# Altium project Sayma_AMC.PrjPcb (part 11 of 18)

## Sheet CPU_LPC1776.SchDoc: Sayma AMC
size 420 x 297 mm; $$Internal___BlkDate: 17:09:51_11-23-16; $$Internal_Resolution: 00001mm; $$NotCommonProperty_@NAME: CPU_LPC1776; $$NotCommonProperty_@PRINTORDER: 14; $$NotCommonProperty_@SHEET: 1; $$NotCommonProperty_@SHEETTOTAL: 30; $$NotCommonProperty_FORWARD_PCB: 0; CmpIndex: 51; Drawing Author: G.Kasprowicz; Drawing Number: Sayma AMC; Drawing Project: AMC FMC Carrier Board; Drawing Revision: 2.0; SymIndex: 1557; CheckedBy: P.Kulik,T.Przywozki,W.Ruclo; Author: G.Kasprowicz; CompanyName: WUT ISE; DrawnBy: G.Kasprowicz; Organization: WUT ISE; Address1: PW ISE; Address2: Nowowiejska 15/19 00-665 Warsaw; Address3: gkasprow@gmail.com; DocumentNumber: 5; Revision: 2; SheetNumber: 5; SheetTotal: 32; ModifiedBy: -; CheckedDate: -; Title2: MMC; DivGrp: WUT ISE; Designer: G.Kasprowicz; ModifiedDate: -; ProjectName: Sensor Box
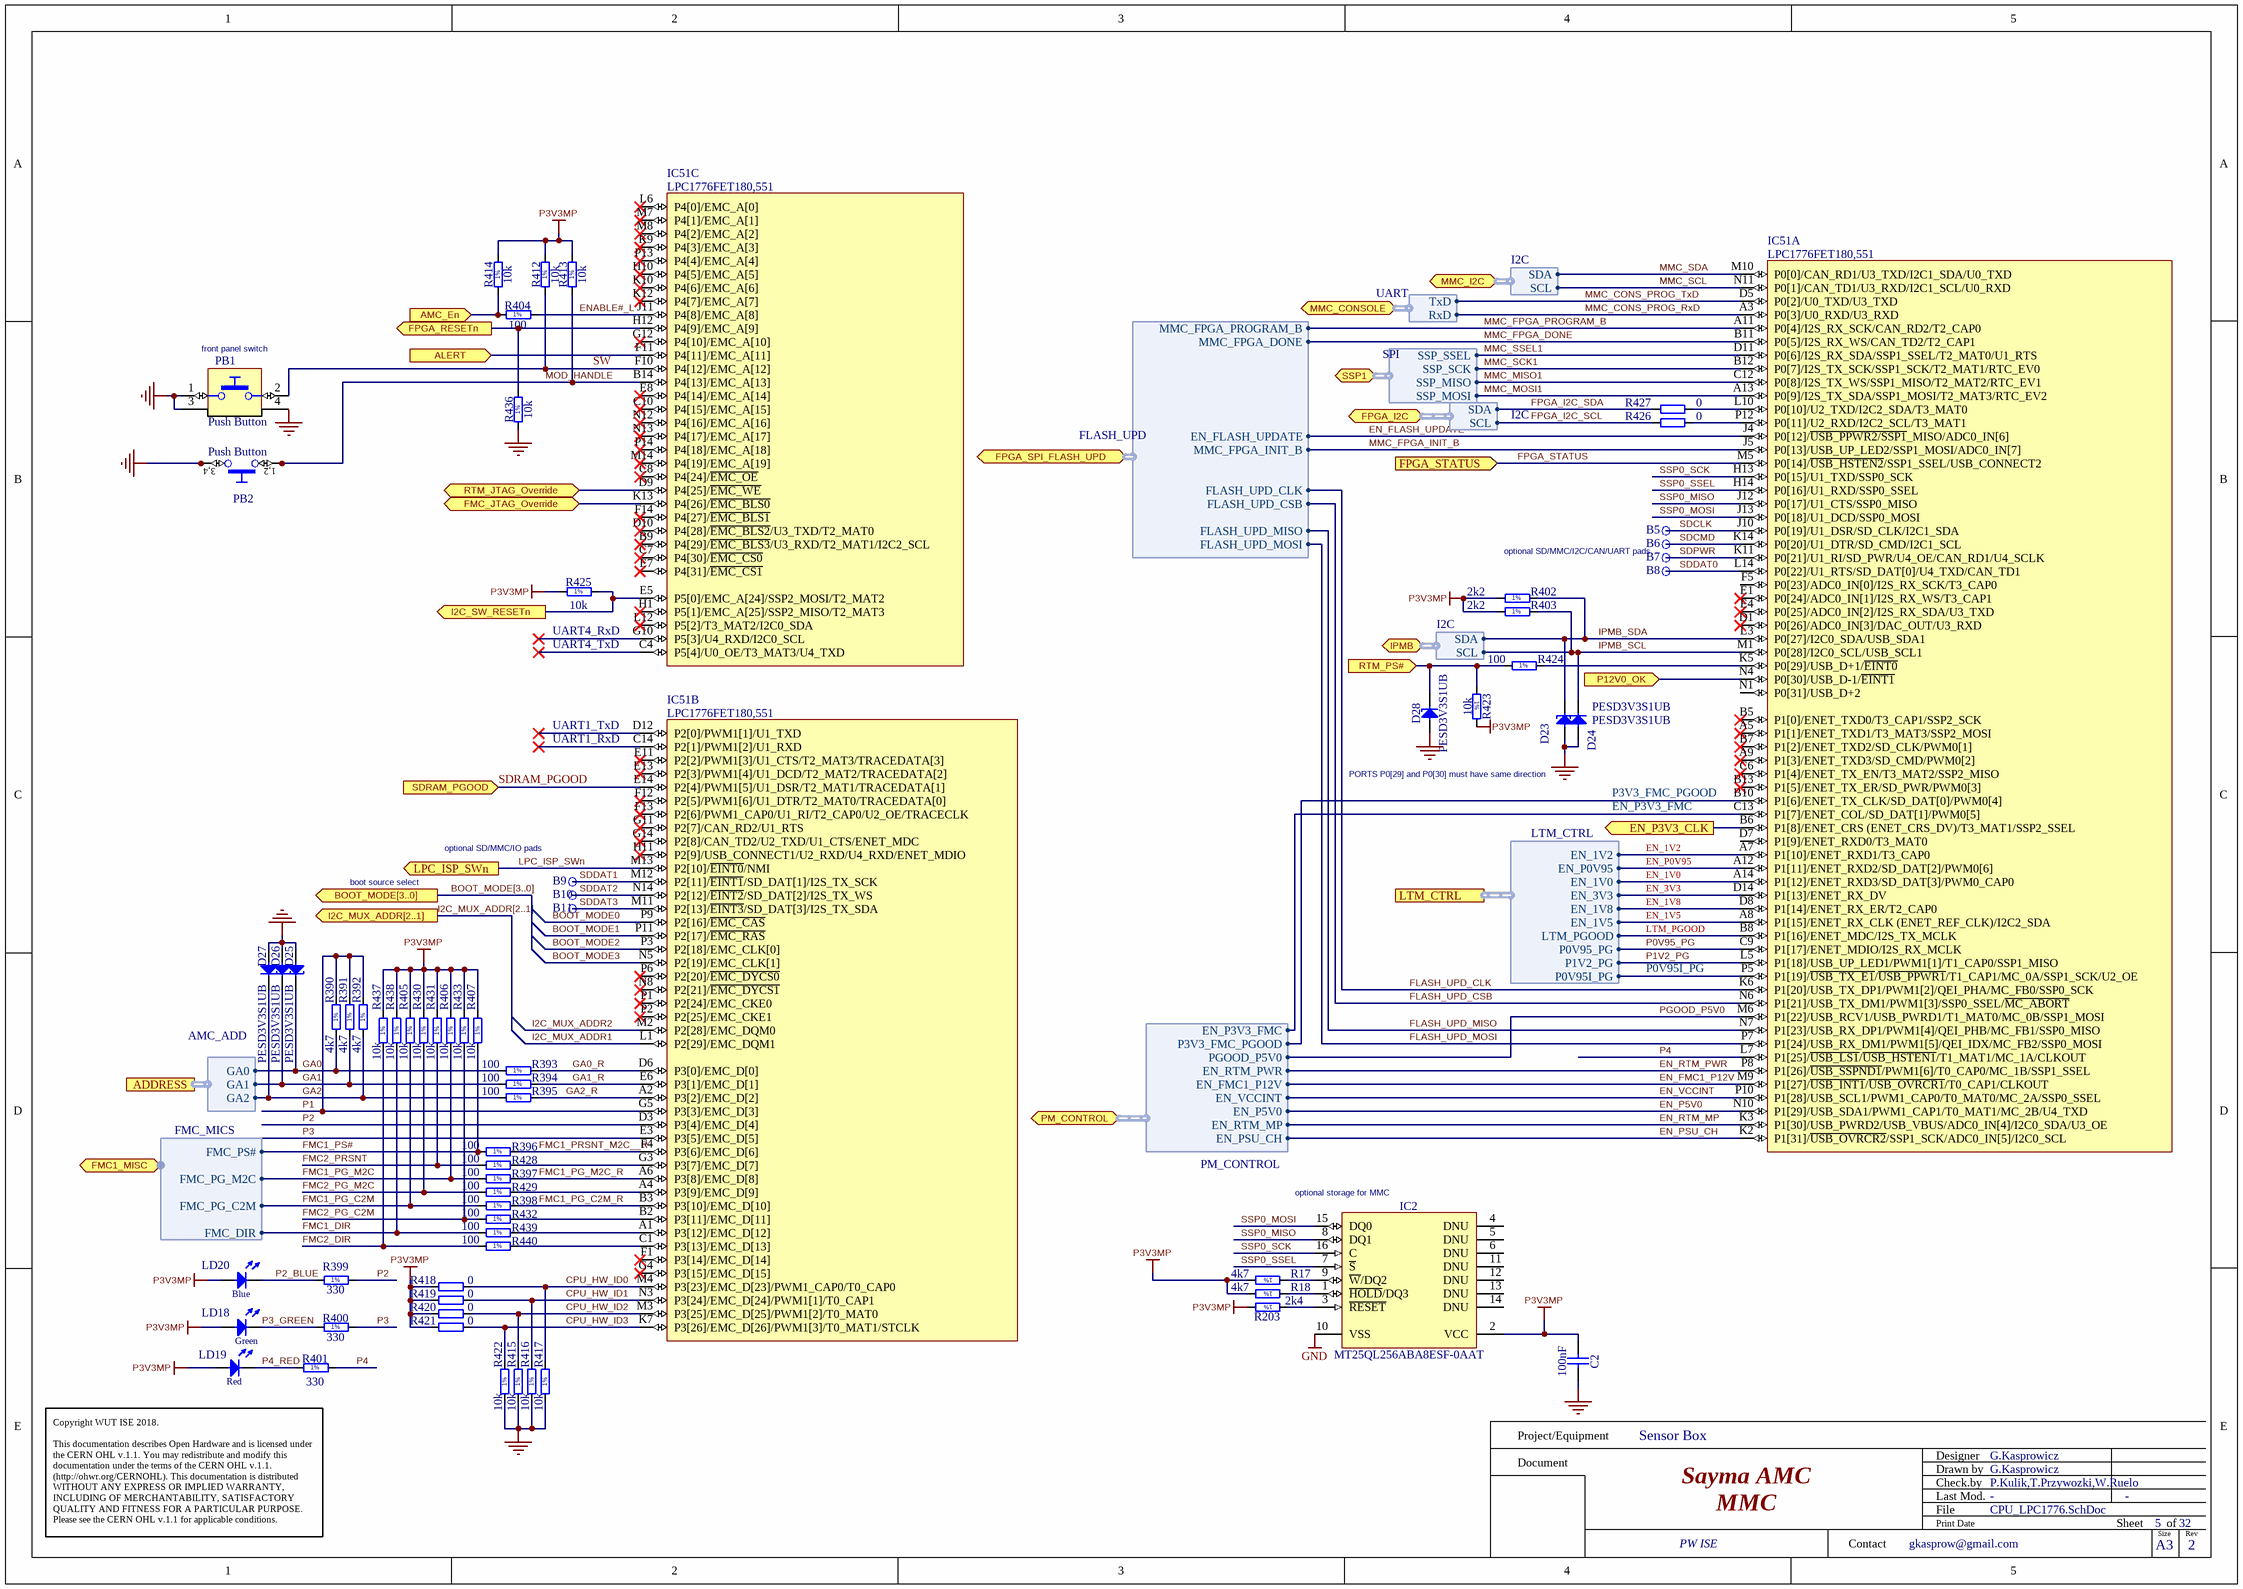
[diagram p18: CPU_LPC1776.SchDoc]

### Parts
B5  SMD_PAD_D1MM  [C100]  (value not drawn)
B6  SMD_PAD_D1MM  [C100]  (value not drawn)
B7  SMD_PAD_D1MM  [C100]  (value not drawn)
B8  SMD_PAD_D1MM  [C100]  (value not drawn)
B9  SMD_PAD_D1MM  [C100]  (value not drawn)
B10  SMD_PAD_D1MM  [C100]  (value not drawn)
B11  SMD_PAD_D1MM  [C100]  (value not drawn)
C2  100nF  [CAPC0603X33N]
D23  PESD3V3S1UB  [SODFL1608X65N]
D24  PESD3V3S1UB  [SODFL1608X65N]
D25  PESD3V3S1UB  [SODFL1608X65N]
D26  PESD3V3S1UB  [SODFL1608X65N]
D27  PESD3V3S1UB  [SODFL1608X65N]
D28  PESD3V3S1UB  [SODFL1608X65N]
IC2  MT25QL256ABA8ESF-0AAT  [SOIC127P1030X265-16N]
IC51  LPC1776FET180,551  [BGA180C80P14X14_1200X1200X120]  (parts A,B,C of 5)
LD18  Green  [LED_AVAGO_HSME-C120]
LD19  Red  [LED_KINGBRIGHT_KPH-1608SURCK]
LD20  Blue  [LED_AVAGO_HSMR-C120]  (value not drawn)
PB1  Push Button  [PB_ALPS_SKHHLQA010]
PB2  Push Button  [SW_C&K_HDT0001]
R17  4k7  [RESC1005X40N]
R18  4k7  [RESC1005X40N]
R203  2k4  [RESC1005X40N]
R390  4k7  [RESC1005X40N]
R391  4k7  [RESC1005X40N]
R392  4k7  [RESC1005X40N]
R393  100  [RESC1005X40N]
R394  100  [RESC1005X40N]
R395  100  [RESC1005X40N]
R396  100  [RESC1005X40N]
R397  100  [RESC1005X40N]
R398  100  [RESC1005X40N]
R399  330  [RESC1005X40N]
R400  330  [RESC1005X40N]
R401  330  [RESC1005X40N]
R402  2k2  [RESC1005X40N]
R403  2k2  [RESC1005X40N]
R404  100  [RESC1005X40N]
R405  10k  [RESC1005X40N]
R406  10k  [RESC1005X40N]
R407  10k  [RESC1005X40N]
R412  10k  [RESC1005X40N]
R413  10k  [RESC1005X40N]
R414  10k  [RESC1005X40N]
R415  10k  [RESC1005X40N]
R416  10k  [RESC1005X40N]
R417  10k  [RESC1005X40N]
R418  0  [RESC1005X40N]
R419  0  [RESC1005X40N]
R420  0  [RESC1005X40N]
R421  0  [RESC1005X40N]
R422  10k  [RESC1005X40N]
R423  10k  [RESC1005X40N]
R424  100  [RESC1005X40N]
R425  10k  [RESC1005X40N]
R426  0  [RESC1005X40N]
R427  0  [RESC1005X40N]
R428  100  [RESC1005X40N]
R429  100  [RESC1005X40N]
R430  10k  [RESC1005X40N]
R431  10k  [RESC1005X40N]
R432  100  [RESC1005X40N]
R433  10k  [RESC1005X40N]
R436  10k  [RESC1005X40N]
R437  10k  [RESC1005X40N]
R438  10k  [RESC1005X40N]
R439  100  [RESC1005X40N]
R440  100  [RESC1005X40N]

### Ports
ADDRESS (harness AMC_ADD), ALERT (in), AMC_En (in), BOOT_MODE[3..0] (out), EN_P3V3_CLK (out), FMC1_MISC (bidir, harness FMC_MICS), FMC_JTAG_Override (bidir), FPGA_I2C (bidir, harness I2C), FPGA_RESETn (out), FPGA_SPI_FLASH_UPD (bidir, harness FLASH_UPD), FPGA_STATUS (in), I2C_MUX_ADDR[2..1] (out), I2C_SW_RESETn (out), IPMB (bidir, harness I2C), LPC_ISP_SWn (out), LTM_CTRL (harness LTM_CTRL), MMC_CONSOLE (bidir, harness UART), MMC_I2C (bidir, harness I2C), P12V0_OK (in), PM_CONTROL (bidir, harness PM_CONTROL), RTM_JTAG_Override (bidir), RTM_PS# (in), SDRAM_PGOOD (in), SSP1 (bidir, harness SPI)

### Harnesses
AMC_ADD: GA0, GA1, GA2
FMC_MICS: FMC_PS#, FMC_PG_M2C, FMC_PG_C2M, FMC_DIR
I2C: SCL, SDA
FLASH_UPD: MMC_FPGA_PROGRAM_B, MMC_FPGA_DONE, EN_FLASH_UPDATE, MMC_FPGA_INIT_B, FLASH_UPD_CLK, FLASH_UPD_CSB, FLASH_UPD_MISO, FLASH_UPD_MOSI
PM_CONTROL: PGOOD_P5V0, EN_RTM_PWR, EN_FMC1_P12V, EN_VCCINT, EN_P5V0, EN_RTM_MP, EN_PSU_CH, EN_P3V3_FMC, P3V3_FMC_PGOOD
UART: RxD, TxD
SPI: SSP_SCK, SSP_SSEL, SSP_MISO, SSP_MOSI
LTM_CTRL: EN_1V0, EN_3V3, EN_1V8, EN_1V5, LTM_PGOOD, EN_1V2, EN_P0V95, P1V2_PG, P0V95I_PG, P0V95_PG

### Nets
GND: C2.1 D23.2(A) D24.2(A) D25.2(A) D26.2(A) D27.2(A) D28.2(A) IC2.10(VSS) PB1.1 PB1.3 PB1.4 PB2.3 PB2.4 R415.1 R416.1 R417.1 R422.1 R436.1
P3V3MP: C2.2 IC2.2(VCC) LD18.2(A) LD19.2(A) LD20.2(A) R17.2 R18.2 R203.2 R402.1 R403.1 R405.2 R406.2 R407.2 R412.2 R413.2 R414.2 R418.1 R419.1 R420.1 R421.1 R423.2 R425.1 R430.2 R431.2 R433.2 R437.2 R438.2
AMC_En: R404.1 R414.1 ; port AMC_En
BOOT_MODE0: IC51.P9(P2[16]/~{EMC_CAS})
BOOT_MODE1: IC51.P11(P2[17]/~{EMC_RAS})
BOOT_MODE2: IC51.P3(P2[18]/EMC_CLK[0])
BOOT_MODE3: IC51.N5(P2[19]/EMC_CLK[1])
CPU_HW_ID0: IC51.M4(P3[23]/EMC_D[23]/PWM1_CAP0/T0_CAP0) R417.2 R418.2
CPU_HW_ID1: IC51.N3(P3[24]/EMC_D[24]/PWM1[1]/T0_CAP1) R416.2 R419.2
CPU_HW_ID2: IC51.M3(P3[25]/EMC_D[25]/PWM1[2]/T0_MAT0) R415.2 R420.2
CPU_HW_ID3: IC51.K7(P3[26]/EMC_D[26]/PWM1[3]/T0_MAT1/STCLK) R421.2 R422.2
EN_1V0: IC51.A14(P1[12]/ENET_RXD3/SD_DAT[3]/PWM0_CAP0) ; port LTM_CTRL.EN_1V0
EN_1V2: IC51.A7(P1[10]/ENET_RXD1/T3_CAP0) ; port LTM_CTRL.EN_1V2
EN_1V5: IC51.A8(P1[15]/ENET_RX_CLK_(ENET_REF_CLK)/I2C2_SDA) ; port LTM_CTRL.EN_1V5
EN_1V8: IC51.D8(P1[14]/ENET_RX_ER/T2_CAP0) ; port LTM_CTRL.EN_1V8
EN_3V3: IC51.D14(P1[13]/ENET_RX_DV) ; port LTM_CTRL.EN_3V3
EN_FLASH_UPDATE: IC51.J4(P0[12]/~{USB_PPWR2/SSP1}_MISO/ADC0_IN[6]) ; port FPGA_SPI_FLASH_UPD.EN_FLASH_UPDATE
EN_FMC1_P12V: IC51.M9(P1[27]/~{USB_INT1}/~{USB_OVRCR1}/T0_CAP1/CLKOUT) ; port PM_CONTROL.EN_FMC1_P12V
EN_P0V95: IC51.A12(P1[11]/ENET_RXD2/SD_DAT[2]/PWM0[6]) ; port LTM_CTRL.EN_P0V95
EN_P3V3_FMC: IC51.C13(P1[7]/ENET_COL/SD_DAT[1]/PWM0[5]) ; port PM_CONTROL.EN_P3V3_FMC
EN_P5V0: IC51.N10(P1[29]/USB_SDA1/PWM1_CAP1/T0_MAT1/MC_2B/U4_TXD) ; port PM_CONTROL.EN_P5V0
EN_PSU_CH: IC51.K2(P1[31]/~{USB_OVRCR2}/SSP1_SCK/ADC0_IN[5]/I2C0_SCL) ; port PM_CONTROL.EN_PSU_CH
EN_RTM_MP: IC51.K3(P1[30]/USB_PWRD2/USB_VBUS/ADC0_IN[4]/I2C0_SDA/U3_OE) ; port PM_CONTROL.EN_RTM_MP
EN_RTM_PWR: IC51.P8(P1[26]/~{USB_SSPND1}/PWM1[6]/T0_CAP0/MC_1B/SSP1_SSEL) ; port PM_CONTROL.EN_RTM_PWR
EN_VCCINT: IC51.P10(P1[28]/USB_SCL1/PWM1_CAP0/T0_MAT0/MC_2A/SSP0_SSEL) ; port PM_CONTROL.EN_VCCINT
ENABLE#_L: IC51.J11(P4[8]/EMC_A[8]) R404.2
FLASH_UPD_CLK: IC51.K6(P1[20]/USB_TX_DP1/PWM1[2]/QEI_PHA/MC_FB0/SSP0_SCK) ; port FPGA_SPI_FLASH_UPD.FLASH_UPD_CLK
FLASH_UPD_CSB: IC51.N6(P1[21]/USB_TX_DM1/PWM1[3]/SSP0_SSEL/~{MC_ABORT}) ; port FPGA_SPI_FLASH_UPD.FLASH_UPD_CSB
FLASH_UPD_MISO: IC51.N7(P1[23]/USB_RX_DP1/PWM1[4]/QEI_PHB/MC_FB1/SSP0_MISO) ; port FPGA_SPI_FLASH_UPD.FLASH_UPD_MISO
FLASH_UPD_MOSI: IC51.P7(P1[24]/USB_RX_DM1/PWM1[5]/QEI_IDX/MC_FB2/SSP0_MOSI) ; port FPGA_SPI_FLASH_UPD.FLASH_UPD_MOSI
FMC1_DIR: R438.1 R439.1 ; port FMC1_MISC.FMC_DIR  [project net CLK_DIR]
FMC1_PG_C2M: R398.1 R405.1 ; port FMC1_MISC.FMC_PG_C2M
FMC1_PG_C2M_R: IC51.B3(P3[10]/EMC_D[10]) R398.2
FMC1_PG_M2C: R397.1 R406.1 ; port FMC1_MISC.FMC_PG_M2C
FMC1_PG_M2C_R: IC51.A6(P3[8]/EMC_D[8]) R397.2
FMC1_PRSNT_M2C__R: IC51.F4(P3[6]/EMC_D[6]) R396.2
FMC1_PS#: R396.1 R407.1 ; port FMC1_MISC.FMC_PS#
FMC2_DIR: R437.1 R440.1
FMC2_PG_C2M: R432.1 R433.1
FMC2_PG_M2C: R429.1 R430.1
FMC2_PRSNT: R428.1 R431.1
FPGA_I2C_SCL: R426.1 ; port FPGA_I2C.SCL
FPGA_I2C_SDA: R427.1 ; port FPGA_I2C.SDA
FPGA_RESETn: IC51.H12(P4[9]/EMC_A[9]) R436.2 ; port FPGA_RESETn
FPGA_STATUS: IC51.M5(P0[14]/~{USB_HSTEN2}/SSP1_SSEL/USB_CONNECT2) ; port FPGA_STATUS
GA0: D25.1(C) R390.1 R393.1 ; port ADDRESS.GA0
GA0_R: IC51.D6(P3[0]/EMC_D[0]) R393.2
GA1: D26.1(C) R391.1 R394.1 ; port ADDRESS.GA1
GA1_R: IC51.E6(P3[1]/EMC_D[1]) R394.2
GA2: D27.1(C) R392.1 R395.1 ; port ADDRESS.GA2
GA2_R: IC51.A2(P3[2]/EMC_D[2]) R395.2
I2C_MUX_ADDR1: IC51.L1(P2[29]/EMC_DQM1)
I2C_MUX_ADDR2: IC51.M2(P2[28]/EMC_DQM0)
IPMB_SCL: D24.1(C) IC51.M1(P0[28]/I2C0_SCL/USB_SCL1) R403.2 ; port IPMB.SCL
IPMB_SDA: D23.1(C) IC51.L3(P0[27]/I2C0_SDA/USB_SDA1) R402.2 ; port IPMB.SDA
LPC_ISP_SWn: IC51.M13(P2[10]/~{EINT0}/NMI) ; port LPC_ISP_SWn
LTM_PGOOD: IC51.B8(P1[16]/ENET_MDC/I2S_TX_MCLK) ; port LTM_CTRL.LTM_PGOOD
MMC_CONS_PROG_RxD: IC51.A3(P0[3]/U0_RXD/U3_RXD) ; port MMC_CONSOLE.RxD
MMC_CONS_PROG_TxD: IC51.D5(P0[2]/U0_TXD/U3_TXD) ; port MMC_CONSOLE.TxD
MMC_FPGA_DONE: IC51.B11(P0[5]/I2S_RX_WS/CAN_TD2/T2_CAP1) ; port FPGA_SPI_FLASH_UPD.MMC_FPGA_DONE
MMC_FPGA_INIT_B: IC51.J5(P0[13]/USB_UP_LED2/SSP1_MOSI/ADC0_IN[7]) ; port FPGA_SPI_FLASH_UPD.MMC_FPGA_INIT_B
MMC_FPGA_PROGRAM_B: IC51.A11(P0[4]/I2S_RX_SCK/CAN_RD2/T2_CAP0) ; port FPGA_SPI_FLASH_UPD.MMC_FPGA_PROGRAM_B
MMC_MISO1: IC51.C12(P0[8]/I2S_TX_WS/SSP1_MISO/T2_MAT2/RTC_EV1) ; port SSP1.SSP_MISO
MMC_MOSI1: IC51.A13(P0[9]/I2S_TX_SDA/SSP1_MOSI/T2_MAT3/RTC_EV2) ; port SSP1.SSP_MOSI
MMC_SCK1: IC51.B12(P0[7]/I2S_TX_SCK/SSP1_SCK/T2_MAT1/RTC_EV0) ; port SSP1.SSP_SCK
MMC_SCL: IC51.N11(P0[1]/CAN_TD1/U3_RXD/I2C1_SCL/U0_RXD) ; port MMC_I2C.SCL
MMC_SDA: IC51.M10(P0[0]/CAN_RD1/U3_TXD/I2C1_SDA/U0_TXD) ; port MMC_I2C.SDA
MMC_SSEL1: IC51.D11(P0[6]/I2S_RX_SDA/SSP1_SSEL/T2_MAT0/U1_RTS) ; port SSP1.SSP_SSEL
MOD_HANDLE: IC51.B14(P4[13]/EMC_A[13]) PB2.1 PB2.2 R413.1
P0V95_PG: IC51.C9(P1[17]/ENET_MDIO/I2S_RX_MCLK) ; port LTM_CTRL.P0V95_PG
P0V95I_PG: IC51.P5(P1[19]/~{USB_TX_E1}/~{USB_PPWR1}/T1_CAP1/MC_0A/SSP1_SCK/U2_OE) ; port LTM_CTRL.P0V95I_PG
P1: IC51.G5(P3[3]/EMC_D[3]) R390.2 R391.2 R392.2
P1V2_PG: IC51.L5(P1[18]/USB_UP_LED1/PWM1[1]/T1_CAP0/SSP1_MISO) ; port LTM_CTRL.P1V2_PG
P2: IC51.D3(P3[4]/EMC_D[4]) R399.2
P2_BLUE: LD20.1(C) R399.1
P3: IC51.E3(P3[5]/EMC_D[5]) R400.2
P3_GREEN: LD18.1(C) R400.1
P3V3_FMC_PGOOD: IC51.B10(P1[6]/ENET_TX_CLK/SD_DAT[0]/PWM0[4]) ; port PM_CONTROL.P3V3_FMC_PGOOD
P4: IC51.L7(P1[25]/~{USB_LS1}/~{USB_HSTEN1}/T1_MAT1/MC_1A/CLKOUT) R401.2
P4_RED: LD19.1(C) R401.1
PGOOD_P5V0: IC51.M6(P1[22]/USB_RCV1/USB_PWRD1/T1_MAT0/MC_0B/SSP1_MOSI) ; port PM_CONTROL.PGOOD_P5V0
SDCLK: B5.1 IC51.J10(P0[19]/U1_DSR/SD_CLK/I2C1_SDA)
SDCMD: B6.1 IC51.K14(P0[20]/U1_DTR/SD_CMD/I2C1_SCL)
SDDAT0: B8.1 IC51.L14(P0[22]/U1_RTS/SD_DAT[0]/U4_TXD/CAN_TD1)
SDDAT1: B9.1 IC51.M12(P2[11]/~{EINT1}/SD_DAT[1]/I2S_TX_SCK)
SDDAT2: B10.1 IC51.N14(P2[12]/~{EINT2}/SD_DAT[2]/I2S_TX_WS)
SDDAT3: B11.1 IC51.M11(P2[13]/~{EINT3}/SD_DAT[3]/I2S_TX_SDA)
SDPWR: B7.1 IC51.K11(P0[21]/U1_RI/SD_PWR/U4_OE/CAN_RD1/U4_SCLK)
SDRAM_PGOOD: IC51.E14(P2[4]/PWM1[5]/U1_DSR/T2_MAT1/TRACEDATA[1]) ; port SDRAM_PGOOD
SSP0_MISO: IC2.8(DQ1) IC51.J12(P0[17]/U1_CTS/SSP0_MISO)
SSP0_MOSI: IC2.15(DQ0) IC51.J13(P0[18]/U1_DCD/SSP0_MOSI)
SSP0_SCK: IC2.16(C) IC51.H13(P0[15]/U1_TXD/SSP0_SCK)
SSP0_SSEL: IC2.7(~{S}) IC51.H14(P0[16]/U1_RXD/SSP0_SSEL)
SW: IC51.F10(P4[12]/EMC_A[12]) PB1.2 R412.1
NetD6_2: IC51.K13(P4[26]/~{EMC_BLS0}) ; port FMC_JTAG_Override
NetD7_2: IC51.D9(P4[25]/~{EMC_WE}) ; port RTM_JTAG_Override
NetD28_1: D28.1(C) R423.1 R424.1 ; port RTM_PS#
NetIC1_1: IC51.B6(P1[8]/ENET_CRS_(ENET_CRS_DV)/T3_MAT1/SSP2_SSEL) ; port EN_P3V3_CLK
NetIC2_1: IC2.1(~{HOLD}/DQ3) R18.1
NetIC2_3: IC2.3(~{RESET}) R203.1
NetIC2_9: IC2.9(~{W}/DQ2) R17.1
NetIC16_1: IC51.N4(P0[30]/USB_D-1/~{EINT1}) ; port P12V0_OK
NetIC45_3: IC51.F11(P4[11]/EMC_A[11]) ; port ALERT
NetIC51_A1: IC51.A1(P3[12]/EMC_D[12]) R439.2
NetIC51_A4: IC51.A4(P3[9]/EMC_D[9]) R429.2
NetIC51_B2: IC51.B2(P3[11]/EMC_D[11]) R432.2
NetIC51_C1: IC51.C1(P3[13]/EMC_D[13]) R440.2
NetIC51_E5: IC51.E5(P5[0]/EMC_A[24]/SSP2_MOSI/T2_MAT2) R425.2 ; port I2C_SW_RESETn
NetIC51_G3: IC51.G3(P3[7]/EMC_D[7]) R428.2
NetIC51_K5: IC51.K5(P0[29]/USB_D+1/~{EINT0}) R424.2
NetIC51_L10: IC51.L10(P0[10]/U2_TXD/I2C2_SDA/T3_MAT0) R427.2
NetIC51_P12: IC51.P12(P0[11]/U2_RXD/I2C2_SCL/T3_MAT1) R426.2

Not connected (* = marked no-connect by the designer): IC2 4(DNU) 5(DNU) 6(DNU) 11(DNU) 12(DNU) 13(DNU) 14(DNU); IC51 A5(P1[1]/ENET_TXD1/T3_MAT3/SSP2_MOSI)* A9(P1[3]/ENET_TXD3/SD_CMD/PWM0[2])* B5(P1[0]/ENET_TXD0/T3_CAP1/SSP2_SCK)* B7(P1[2]/ENET_TXD2/SD_CLK/PWM0[1])* B9(P4[29]/~{EMC_BLS3}/U3_RXD/T2_MAT1/I2C2_SCL)* B13(P1[5]/ENET_TX_ER/SD_PWR/PWM0[3])* C4(P5[4]/U0_OE/T3_MAT3/U4_TXD)* C6(P1[4]/ENET_TX_EN/T3_MAT2/SSP2_MISO)* C7(P4[30]/~{EMC_CS0})* C8(P4[24]/~{EMC_OE})* C10(P4[15]/EMC_A[15])* C14(P2[1]/PWM1[2]/U1_RXD)* D1(P0[26]/ADC0_IN[3]/DAC_OUT/U3_RXD)* D7(P1[9]/ENET_RXD0/T3_MAT0) D10(P4[28]/~{EMC_BLS2}/U3_TXD/T2_MAT0)* D12(P2[0]/PWM1[1]/U1_TXD)* E1(P0[24]/ADC0_IN[1]/I2S_RX_WS/T3_CAP1)* E4(P0[25]/ADC0_IN[2]/I2S_RX_SDA/U3_TXD)* E7(P4[31]/~{EMC_CS1})* E8(P4[14]/EMC_A[14])* E11(P2[2]/PWM1[3]/U1_CTS/T2_MAT3/TRACEDATA[3])* E13(P2[3]/PWM1[4]/U1_DCD/T2_MAT2/TRACEDATA[2])* F1(P3[14]/EMC_D[14])* F5(P0[23]/ADC0_IN[0]/I2S_RX_SCK/T3_CAP0) F12(P2[5]/PWM1[6]/U1_DTR/T2_MAT0/TRACEDATA[0])* F13(P2[6]/PWM1_CAP0/U1_RI/T2_CAP0/U2_OE/TRACECLK)* F14(P4[27]/~{EMC_BLS1})* G4(P3[15]/EMC_D[15])* G10(P5[3]/U4_RXD/I2C0_SCL)* G11(P2[7]/CAN_RD2/U1_RTS)* G12(P4[10]/EMC_A[10])* G14(P2[8]/CAN_TD2/U2_TXD/U1_CTS/ENET_MDC)* H1(P5[1]/EMC_A[25]/SSP2_MISO/T2_MAT3)* H10(P4[5]/EMC_A[5])* H11(P2[9]/USB_CONNECT1/U2_RXD/U4_RXD/ENET_MDIO)* K9(P4[3]/EMC_A[3])* K10(P4[6]/EMC_A[6])* K12(P4[7]/EMC_A[7])* L6(P4[0]/EMC_A[0])* L12(P5[2]/T3_MAT2/I2C0_SDA)* M7(P4[1]/EMC_A[1])* M8(P4[2]/EMC_A[2])* M14(P4[19]/EMC_A[19])* N1(P0[31]/USB_D+2) N8(P2[21]/~{EMC_DYCS1})* N12(P4[16]/EMC_A[16])* N13(P4[17]/EMC_A[17])* P1(P2[24]/EMC_CKE0)* P2(P2[25]/EMC_CKE1)* P6(P2[20]/~{EMC_DYCS0})* P13(P4[4]/EMC_A[4])* P14(P4[18]/EMC_A[18])*

### Buses and harness runs
bus BOOT_MODE[3..0] = port BOOT_MODE[3..0]
bus I2C_MUX_ADDR[2..1] = port I2C_MUX_ADDR[2..1]

### Notes on the sheet
- (near PB1) front panel switch
- optional SD/MMC/I2C/CAN/UART pads
- (near R425) UART4_RxD
- UART4_TxD
- UART1_TxD
- UART1_RxD
- PORTS P0[29] and P0[30] must have same direction
- optional SD/MMC/IO pads
- boot source select
- (near IC2) optional storage for MMC
- Project/Equipment
- Document
- Designer
- Drawn by
- Check.by
- Copyright WUT ISE 2018.
  This documentation describes Open Hardware and is licensed under the CERN OHL v.1.1. You may redistribute and modify this documentation under the terms of the CERN OHL v.1.1. (http://ohwr.org/CERNOHL). This documentation is distributed WITHOUT ANY EXPRESS OR IMPLIED WARRANTY, INCLUDING OF MERCHANTABILITY, SATISFACTORY QUALITY AND FITNESS FOR A PARTICULAR PURPOSE. Please see the CERN OHL v.1.1 for applicable conditions.
- Contact
- File
- Last Mod.
- Print Date
- Sheet
- Size
- A3
- of
- Rev
- (in symbol R0402_2K2_1%_0.0625W_100PPM) 1%
- (in symbol R0402_2K4_1%_0.0625W_100PPM) 1%
- (in symbol R0402_4K7_1%_0.0625W_100PPM) 1%
- (in symbol R0402_10K_1%_0.0625W_100PPM) 1%
- (in symbol R0402_100R_1%_0.1W_100PPM) 1%
- (in symbol R0402_330R_1%_0.0625W_100PPM) 1%
- (in symbol SW_C&K_HDT0001) 3,4; 1,2

### Library data of the parts
B5 = C100: $$NotCommonProperty_Partition: Pads; Part Description: 1mm Diameter SMD Pad; $$Internal_Resolution: 00001mm; $$NotCommonProperty_Family: SMD Pad; $$NotCommonProperty_Mounted: No; $$NotCommonProperty_Pin Count: 1; $$NotCommonProperty_Sense: No; $$NotCommonProperty_Status: None; CmpIndex: 236; Ref Designator: B5; SymIndex: 2108; $$NotCommonProperty_ComponentHeight: 0mm; $$NotCommonProperty_Footprint Ref: C100; $$NotCommonProperty_SMD: No; $$NotCommonProperty_Socket: No; Cell Name: C100; PackageDescription: 1mm Diameter SMD Pad; Part Name: SMD_PAD_D1MM; Part Number: SMD_PAD_D1MM; Orientation: 0 = 0
B6 = C100: $$NotCommonProperty_Partition: Pads; Part Description: 1mm Diameter SMD Pad; $$Internal_Resolution: 00001mm; $$NotCommonProperty_Family: SMD Pad; $$NotCommonProperty_Mounted: No; $$NotCommonProperty_Pin Count: 1; $$NotCommonProperty_Sense: No; $$NotCommonProperty_Status: None; CmpIndex: 237; Ref Designator: B6; SymIndex: 2108; $$NotCommonProperty_ComponentHeight: 0mm; $$NotCommonProperty_Footprint Ref: C100; $$NotCommonProperty_SMD: No; $$NotCommonProperty_Socket: No; Cell Name: C100; PackageDescription: 1mm Diameter SMD Pad; Part Name: SMD_PAD_D1MM; Part Number: SMD_PAD_D1MM; Orientation: 0 = 0
B7 = C100: $$NotCommonProperty_Partition: Pads; Part Description: 1mm Diameter SMD Pad; $$Internal_Resolution: 00001mm; $$NotCommonProperty_Family: SMD Pad; $$NotCommonProperty_Mounted: No; $$NotCommonProperty_Pin Count: 1; $$NotCommonProperty_Sense: No; $$NotCommonProperty_Status: None; CmpIndex: 238; Ref Designator: B7; SymIndex: 2108; $$NotCommonProperty_ComponentHeight: 0mm; $$NotCommonProperty_Footprint Ref: C100; $$NotCommonProperty_SMD: No; $$NotCommonProperty_Socket: No; Cell Name: C100; PackageDescription: 1mm Diameter SMD Pad; Part Name: SMD_PAD_D1MM; Part Number: SMD_PAD_D1MM; Orientation: 0 = 0
B8 = C100: $$NotCommonProperty_Partition: Pads; Part Description: 1mm Diameter SMD Pad; $$Internal_Resolution: 00001mm; $$NotCommonProperty_Family: SMD Pad; $$NotCommonProperty_Mounted: No; $$NotCommonProperty_Pin Count: 1; $$NotCommonProperty_Sense: No; $$NotCommonProperty_Status: None; CmpIndex: 256; Ref Designator: B8; SymIndex: 2108; $$NotCommonProperty_ComponentHeight: 0mm; $$NotCommonProperty_Footprint Ref: C100; $$NotCommonProperty_SMD: No; $$NotCommonProperty_Socket: No; Cell Name: C100; PackageDescription: 1mm Diameter SMD Pad; Part Name: SMD_PAD_D1MM; Part Number: SMD_PAD_D1MM; Orientation: 0 = 0
B9 = C100: $$NotCommonProperty_Partition: Pads; Part Description: 1mm Diameter SMD Pad; $$Internal_Resolution: 00001mm; $$NotCommonProperty_Family: SMD Pad; $$NotCommonProperty_Mounted: No; $$NotCommonProperty_Pin Count: 1; $$NotCommonProperty_Sense: No; $$NotCommonProperty_Status: None; CmpIndex: 257; Ref Designator: B9; SymIndex: 2108; $$NotCommonProperty_ComponentHeight: 0mm; $$NotCommonProperty_Footprint Ref: C100; $$NotCommonProperty_SMD: No; $$NotCommonProperty_Socket: No; Cell Name: C100; PackageDescription: 1mm Diameter SMD Pad; Part Name: SMD_PAD_D1MM; Part Number: SMD_PAD_D1MM; Orientation: 0 = 0
B10 = C100: $$NotCommonProperty_Partition: Pads; Part Description: 1mm Diameter SMD Pad; $$Internal_Resolution: 00001mm; $$NotCommonProperty_Family: SMD Pad; $$NotCommonProperty_Mounted: No; $$NotCommonProperty_Pin Count: 1; $$NotCommonProperty_Sense: No; $$NotCommonProperty_Status: None; CmpIndex: 259; Ref Designator: B10; SymIndex: 2108; $$NotCommonProperty_ComponentHeight: 0mm; $$NotCommonProperty_Footprint Ref: C100; $$NotCommonProperty_SMD: No; $$NotCommonProperty_Socket: No; Cell Name: C100; PackageDescription: 1mm Diameter SMD Pad; Part Name: SMD_PAD_D1MM; Part Number: SMD_PAD_D1MM; Orientation: 0 = 0
B11 = C100: $$NotCommonProperty_Partition: Pads; Part Description: 1mm Diameter SMD Pad; $$Internal_Resolution: 00001mm; $$NotCommonProperty_Family: SMD Pad; $$NotCommonProperty_Mounted: No; $$NotCommonProperty_Pin Count: 1; $$NotCommonProperty_Sense: No; $$NotCommonProperty_Status: None; CmpIndex: 261; Ref Designator: B11; SymIndex: 2108; $$NotCommonProperty_ComponentHeight: 0mm; $$NotCommonProperty_Footprint Ref: C100; $$NotCommonProperty_SMD: No; $$NotCommonProperty_Socket: No; Cell Name: C100; PackageDescription: 1mm Diameter SMD Pad; Part Name: SMD_PAD_D1MM; Part Number: SMD_PAD_D1MM; Orientation: 0 = 0
C2 = CC0201_100NF_6.3V_10%_X5R: Non-polarised capacitor; Manufacturer: GENERIC; Part Description: SMD Multilayer Chip Ceramic Capacitor; Manufacturer1 Part Number: 02016D104KAT2A; Tolerance: ±10%; Voltage: 6.3V; TC: X5R; Manufacturer Part Number: CC0201_100NF_6.3V_10%_X5R; Part Number: CC0201_100NF_6.3V_10%_X5R; Value: 100nF; Component Kind: Standard; Component Type: Standard; Pin Count: 2; Status: Not Recommended; Case: 0201; Mounted: Yes; Socket: No; SMD: Yes; Sense: No; Manufacturer1 Example: AVX; Manufacturer1 ComponentHeight: 0.33mm; HelpURL: \\cern.ch\dfs\Applications\Altium\Datasheets\CC0201_X5R_AVX.pdf; Author: CERN DEM JLC; CreateDate: 03.12.2007; LatestRevisionDate: 03.12.2007
D23-D28 = PESD3V3S1UB: ESD protection diode; Manufacturer: NXP SEMICONDUCTORS; Part Description: ESD protection diode (23kV); Voltage: 3V3; Power: 330W; PressFit: No; Bonding: No; Manufacturer Part Number: PESD3V3S1UB; PackageDescription: Ultra Small Outline Diode Flat Lead (SOD-523), Body; 1.2mm L X 0.8mm W X 0.65mm H, IPC Medium Density; Part Number: PESD3V3S1UB; Component Kind: Standard; Component Type: Standard; Device: PESD3V3S1UB; Pin Count: 2; Case: SOD523; Mounted: Yes; Socket: No; SMD: Yes; Sense: No; ComponentHeight: 0.65mm; HelpURL: \\cern.ch\dfs\Applications\Altium\Datasheets\PESD3V3S1UB.pdf; Author: CERN DEM JLC; CreateDate: 29.11.2012; LatestRevisionDate: 29.11.2012
IC2 = MT25QL256ABA8ESF-0AAT: 256Mbit (32MB), 2.7V-3.6V, Multiple I/O Serial NOR Flash Memory,with Reset# & Hold#; Part Description: 256Mbit (32MB), 2.7V-3.6V, Multiple I/O Serial NOR Flash Memory,with Reset# & Hold# (Automotive grade AEC-Q100); Manufacturer: MICRON TECHNOLOGY; PressFit: No; Bonding: No; Part Number: MT25QL256ABA8ESF-0AAT; Component Kind: Standard; Component Type: Standard; Device: MT25QL256ABA8ESF-0AAT; PackageDescription: SOIC 16, Pitch 1.27mm - Body 7.5x10.3mm, IPC Medium Density; Manufacturer Part Number: MT25QL256ABA8ESF-0AAT; Pin Count: 16; Case: SOIC16; Mounted: Yes; Socket: No; SMD: Yes; Sense: No; ComponentHeight: 2.65mm; HelpURL: \\cern.ch\dfs\Applications\Altium\Datasheets\MT25QL256ABA8ESF-0AAT.pdf; Author: CERN DEM JLC; CreateDate: 05.11.2018; LatestRevisionDate: 05.11.2018
IC51 = LPC1776FET180,551: 32-bit ARM Cortex-M3 MCU, 256kB Flash, 80kB SRAM, Ethernet, USB 2.0 Device/Host/OTG, CAN, 12-Bit ADC; Manufacturer: NXP SEMICONDUCTORS; Part Description: Cortex-M3, 32-bit ARM MCU, 256kB Flash, 80kB SRAM, Ethernet, USB 2.0 Device/Host/OTG, CAN, 12-Bit ADC; PressFit: No; Bonding: No; Manufacturer Part Number: LPC1776FET180,551; PackageDescription: BGA, 0.80mm Pitch, Square; 180 Pin, 14 Columns X 14 Rows, Body 12.00mm X 12.00mm X 1.20mm H, IPC Medium Density; Part Number: LPC1776FET180,551; Component Kind: Standard; Component Type: Standard; Device: LPC1776FET180,551; Pin Count: 180; Case: BGA180; Mounted: Yes; Socket: No; SMD: Yes; Sense: No; ComponentHeight: 1.2mm; HelpURL: \\cern.ch\dfs\Applications\Altium\Datasheets\LPC1776FET180,551.pdf; Author: CERN DEM JMW; CreateDate: 16.08.2016; LatestRevisionDate: 16.08.2016
LD18 = LED_AVAGO_HSME-C120: LED Green 1C 2A; Manufacturer: AVAGO TECHNOLOGIES; Part Description: High Performance Right Angle Chip Green LED; PressFit: No; Bonding: No; Manufacturer Part Number: HSME-C120; PackageDescription: Green Chip LED, 2-Leads, Body 1.7x1.1mm, Side Emitting Package; Part Number: LED_AVAGO_HSME-C120; Component Kind: Standard; Component Type: Standard; Color: Green; Pin Count: 2; Mounted: Yes; Socket: No; SMD: Yes; Sense: No; ComponentHeight: 0.7mm; HelpURL: \\cern.ch\dfs\Applications\Altium\Datasheets\LED_AVAGO_HSME-C120.pdf; ComponentLink1URL: \\cern.ch\dfs\Applications\Altium\Datasheets\LED_AVAGO_HSME-C110_DESIGN-GUIDE.pdf; ComponentLink1Description: Design Guide; Author: CERN DEM JMW; CreateDate: 22.07.2009; LatestRevisionDate: 20.06.2012
LD19 = LED_KINGBRIGHT_KPH-1608SURCK: LED Red 1C 2A; Part Description: SMD Hyper Red LED, Case 1.6mmX0.8mm(0603), 0.65mm Thickness; PressFit: No; Bonding: No; Part Number: LED_KINGBRIGHT_KPH-1608SURCK; Component Kind: Standard; Component Type: Standard; Color: Red; PackageDescription: SMT Hyper Red LED, Case 0603, Body L 1.6 x W 0.8mm H 0.65mm; Manufacturer: KINGBRIGHT; Manufacturer Part Number: KPH-1608SURCK; Pin Count: 2; Mounted: Yes; Socket: No; SMD: Yes; Sense: No; ComponentHeight: 0.65mm; HelpURL: \\cern.ch\dfs\Applications\Altium\Datasheets\LED_KINGBRIGHT_KPH-1608SURCK.pdf; Author: CERN DEM JLC; CreateDate: 03.07.2017; LatestRevisionDate: 03.07.2017
LD20 = LED_AVAGO_HSMR-C120: LED Blue 1C 2A; Manufacturer: AVAGO TECHNOLOGIES; Part Description: High Performance Right Angle Chip InGaN Blue LED; PressFit: No; Bonding: No; Manufacturer Part Number: HSMR-C120; PackageDescription: Blue Chip LED, 2-Leads, Body 1.7x1.1mm, Side Emitting Package; Part Number: LED_AVAGO_HSMR-C120; Component Kind: Standard; Component Type: Standard; Color: Blue; Pin Count: 2; Mounted: Yes; Socket: No; SMD: Yes; Sense: No; ComponentHeight: 0.7mm; HelpURL: \\cern.ch\dfs\Applications\Altium\Datasheets\LED_AVAGO_HSMR-C120.pdf; Author: CERN DEM JLC; CreateDate: 07.07.2014; LatestRevisionDate: 07.07.2014
PB1 = PB_ALPS_SKHHLQA010: Push-Button Switch SPDT; Manufacturer: ALPS; Part Description: 6x6mm, SPST Horizontal Pushbutton Switch, Stem height 8.35mm, Contact Rating 50mA 12VDC, SKHH Series; PressFit: No; Sense Comment: Non-washable; Manufacturer Part Number: SKHHLQA010; PackageDescription: Body 6x6mm, Stem height 8.35mm, Horizontal Pushbutton Switch, ALPS Serie SKHH; Part Number: PB_ALPS_SKHHLQA010; Component Kind: Standard; Component Type: Standard; Pin Count: 4; Family: Push Button; Mounted: Yes; Socket: No; SMD: No; Sense: Yes; Status: None; ComponentHeight: 7.4mm; HelpURL: \\cern.ch\dfs\Applications\Altium\Datasheets\PB_ALPS_SKHHLQA010.pdf; Author: CERN DEM JLC; CreateDate: 15.01.2009; LatestRevisionDate: 15.01.2009
PB2 = SW_C&K_HDT0001: Push-Button Switch SPDT; Manufacturer: C&K; Part Description: 5VDC 1mA SPST-NO Micro Mini Surface Surface Mount Detect Push-Button Switch, HDT Series; PressFit: No; Manufacturer Part Number: HDT0001; PackageDescription: Body 3.5x2.8mm, Micro Mini Surface Mount Detect Switches, HDT Serie; Part Number: SW_C&K_HDT0001; Component Kind: Standard; Component Type: Standard; Pin Count: 4; Family: Push Button; Mounted: Yes; Socket: No; SMD: Yes; Sense: No; Status: None; ComponentHeight: 3.35mm; HelpURL: \\cern.ch\dfs\Applications\Altium\Datasheets\SW_C&K_HDT0001.pdf; Author: CERN DEM JLC; CreateDate: 15.08.2012; LatestRevisionDate: 15.08.2012
R17 R18 R390-R392 = R0402_4K7_1%_0.0625W_100PPM: Resistor - 1%; Manufacturer: GENERIC; Part Description: General Purpose Thick Film Chip Resistor; Manufacturer1 Part Number: 232270674702L; TC: ±100ppm/°C; PressFit: No; Manufacturer Part Number: R0402_4K7_1%_0.0625W_100PPM; Part Number: R0402_4K7_1%_0.0625W_100PPM; Tolerance: ±1%; Value: 4k7; Component Kind: Standard; Component Type: Standard; Pin Count: 2; Status: Not Recommended; Power: 0.0625W; Case: 0402; Mounted: Yes; Sense: No; Socket: No; SMD: Yes; Manufacturer1 Example: YAGEO PHYCOMP; Manufacturer1 ComponentHeight: 0.4mm; HelpURL: \\cern.ch\dfs\Applications\Altium\Datasheets\R0402_Phycomp_RC0402.pdf; Author: CERN DEM JLC; CreateDate: 03.12.2007; LatestRevisionDate: 17.10.2012
R203 = R0402_2K4_1%_0.0625W_100PPM: Resistor - 1%; Manufacturer: GENERIC; Part Description: General Purpose Thick Film Chip Resistor; Manufacturer1 Part Number: 232270672402L; TC: ±100ppm/°C; PressFit: No; Manufacturer Part Number: R0402_2K4_1%_0.0625W_100PPM; Part Number: R0402_2K4_1%_0.0625W_100PPM; Tolerance: ±1%; Value: 2k4; Component Kind: Standard; Component Type: Standard; Pin Count: 2; Status: Not Recommended; Power: 0.0625W; Case: 0402; Mounted: Yes; Sense: No; Socket: No; SMD: Yes; Manufacturer1 Example: YAGEO PHYCOMP; Manufacturer1 ComponentHeight: 0.4mm; HelpURL: \\cern.ch\dfs\Applications\Altium\Datasheets\R0402_Phycomp_RC0402.pdf; Author: CERN DEM JLC; CreateDate: 03.12.2007; LatestRevisionDate: 17.10.2012
R393-R398 R404 R424 R428 R429 R432 R439 R440 = R0402_100R_1%_0.1W_100PPM: Resistor - 1%; Manufacturer Part Number: R0402_100R_1%_0.1W_100PPM_50V; Manufacturer: GENERIC; Part Description: General Purpose Thick Film Chip Resistor; Manufacturer1 Part Number: ERJ2RKF1000X; Power: 0.1W; TC: ±100ppm/°C; Voltage: 50V; PressFit: No; Part Number: R0402_100R_1%_0.1W_100PPM; Tolerance: ±1%; Value: 100; Component Kind: Standard; Component Type: Standard; Pin Count: 2; Status: Not Recommended; Case: 0402; Mounted: Yes; Sense: No; Socket: No; SMD: Yes; Manufacturer1 Example: PANASONIC; Manufacturer1 ComponentHeight: 0.4mm; HelpURL: \\cern.ch\dfs\Applications\Altium\Datasheets\R0402_PANASONIC_ERJ2RK.pdf; Author: CERN DEM JLC; CreateDate: 12.12.2013; LatestRevisionDate: 03.03.2015
R399-R401 = R0402_330R_1%_0.0625W_100PPM: Resistor - 1%; Manufacturer: GENERIC; Part Description: General Purpose Thick Film Chip Resistor; Manufacturer1 Part Number: 232270673301L; TC: ±100ppm/°C; PressFit: No; Manufacturer Part Number: R0402_330R_1%_0.0625W_100PPM; Part Number: R0402_330R_1%_0.0625W_100PPM; Tolerance: ±1%; Value: 330; Component Kind: Standard; Component Type: Standard; Pin Count: 2; Status: Not Recommended; Power: 0.0625W; Case: 0402; Mounted: Yes; Sense: No; Socket: No; SMD: Yes; Manufacturer1 Example: YAGEO PHYCOMP; Manufacturer1 ComponentHeight: 0.4mm; HelpURL: \\cern.ch\dfs\Applications\Altium\Datasheets\R0402_Phycomp_RC0402.pdf; Author: CERN DEM JLC; CreateDate: 03.12.2007; LatestRevisionDate: 17.10.2012
R402 R403 = R0402_2K2_1%_0.0625W_100PPM: Resistor - 1%; Manufacturer: GENERIC; Part Description: General Purpose Thick Film Chip Resistor; Manufacturer1 Part Number: 232270672202L; TC: ±100ppm/°C; PressFit: No; Manufacturer Part Number: R0402_2K2_1%_0.0625W_100PPM; Part Number: R0402_2K2_1%_0.0625W_100PPM; Tolerance: ±1%; Value: 2k2; Component Kind: Standard; Component Type: Standard; Pin Count: 2; Status: Not Recommended; Power: 0.0625W; Case: 0402; Mounted: Yes; Sense: No; Socket: No; SMD: Yes; Manufacturer1 Example: YAGEO PHYCOMP; Manufacturer1 ComponentHeight: 0.4mm; HelpURL: \\cern.ch\dfs\Applications\Altium\Datasheets\R0402_Phycomp_RC0402.pdf; Author: CERN DEM JLC; CreateDate: 03.12.2007; LatestRevisionDate: 17.10.2012
R405-R407 R412-R417 R422 R423 R425 R430 R431 R433 R436-R438 = R0402_10K_1%_0.0625W_100PPM: Resistor - 1%; Manufacturer: GENERIC; Part Description: General Purpose Thick Film Chip Resistor; Manufacturer1 Part Number: 232270671003L; TC: ±100ppm/°C; PressFit: No; Manufacturer Part Number: R0402_10K_1%_0.0625W_100PPM; Part Number: R0402_10K_1%_0.0625W_100PPM; Tolerance: ±1%; Value: 10k; Component Kind: Standard; Component Type: Standard; Pin Count: 2; Status: Not Recommended; Power: 0.0625W; Case: 0402; Mounted: Yes; Sense: No; Socket: No; SMD: Yes; Manufacturer1 Example: YAGEO PHYCOMP; Manufacturer1 ComponentHeight: 0.4mm; HelpURL: \\cern.ch\dfs\Applications\Altium\Datasheets\R0402_Phycomp_RC0402.pdf; Author: CERN DEM JLC; CreateDate: 03.12.2007; LatestRevisionDate: 17.10.2012
R418-R421 R426 R427 = R0402_0R_JUMPER: Resistor; Manufacturer: GENERIC; Part Description: 1A (0.05R Max DC Resistance) Zero Ohm Jumper; Manufacturer1 Part Number: 232270591001L; PressFit: No; Manufacturer Part Number: R0402_0R_JUMPER; Part Number: R0402_0R_JUMPER; Value: 0; Component Kind: Standard; Component Type: Standard; Pin Count: 2; Status: Not Recommended; Case: 0402; Mounted: Yes; Sense: No; Socket: No; SMD: Yes; Manufacturer1 Example: YAGEO PHYCOMP; Manufacturer1 ComponentHeight: 0.4mm; HelpURL: \\cern.ch\dfs\Applications\Altium\Datasheets\R0402_Phycomp_RC0402.pdf; Author: CERN DEM JLC; CreateDate: 03.12.2007; LatestRevisionDate: 17.10.2012

## Sheet DUAL_IO_TTL_BUFFER.SchDoc: Sayma AMC
size 420 x 297 mm; $$Internal___BlkDate: 0:12:25_2-9-18; $$Internal_NAME_PLACEHOLDER: a3sheet; $$Internal_Resolution: 00001mm; $$NotCommonProperty_@NAME: DUAL_IO_TTL_BUFFER; $$NotCommonProperty_@SHEET: 1; $$NotCommonProperty_@SHEETTOTAL: 30; CmpIndex: 26; Drawing Author: G.Kasprowicz; Drawing Number: Sayma AMC; Drawing Project: AMC FMC Carrier Board; Drawing Revision: 2.0; SymIndex: 2141; CheckedBy: P.Kulik,T.Przywozki,W.Ruclo; Author: G.Kasprowicz; CompanyName: WUT ISE; DrawnBy: G.Kasprowicz; Organization: WUT ISE; Address1: PW ISE; Address2: Nowowiejska 15/19 00-665 Warsaw; Address3: gkasprow@gmail.com; DocumentNumber: 19; Revision: 2; SheetNumber: 19; SheetTotal: 32; ModifiedBy: -; CheckedDate: -; Title2: Dual LVTTL buffer; DivGrp: WUT ISE; Designer: G.Kasprowicz; ModifiedDate: -; ProjectName: Sensor Box
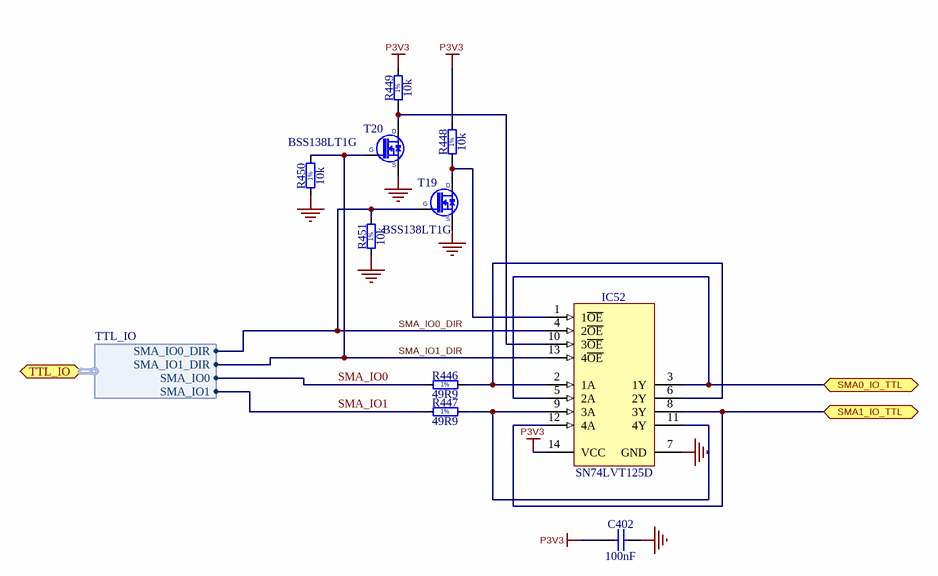
[diagram p19: DUAL_IO_TTL_BUFFER.SchDoc]

### Parts
C402  100nF  [CAPC0603X33N]
IC52  SN74LVT125D  [SOIC127P600X175-14N]
R446  49R9  [RESC1005X40N]
R447  49R9  [RESC1005X40N]
R448  10k  [RESC1005X40N]
R449  10k  [RESC1005X40N]
R450  10k  [RESC1005X40N]
R451  10k  [RESC1005X40N]
T19  BSS138LT1G  [SOT95P240X110-3N]
T20  BSS138LT1G  [SOT95P240X110-3N]

### Ports
SMA0_IO_TTL (bidir), SMA1_IO_TTL (bidir), TTL_IO (bidir, harness TTL_IO)

### Harnesses
TTL_IO: SMA_IO0, SMA_IO1, SMA_IO0_DIR, SMA_IO1_DIR

### Nets
GND: C402.2 IC52.7(GND) R450.1 R451.1 T19.2(S) T20.2(S)
P3V3: C402.1 IC52.14(VCC) R448.2 R449.2
SMA0_IO_TTL: IC52.3(1Y) IC52.5(2A) ; port SMA0_IO_TTL
SMA1_IO_TTL: IC52.8(3Y) IC52.12(4A) ; port SMA1_IO_TTL
SMA_IO0: R446.1 ; port TTL_IO.SMA_IO0
SMA_IO0_DIR: IC52.4(2~{OE}) R451.2 T19.1(G) ; port TTL_IO.SMA_IO0_DIR
SMA_IO1: R447.1 ; port TTL_IO.SMA_IO1
SMA_IO1_DIR: IC52.13(4~{OE}) R450.2 T20.1(G) ; port TTL_IO.SMA_IO1_DIR
NetIC52_1: IC52.1(1~{OE}) R448.1 T19.3(D)
NetIC52_2: IC52.2(1A) IC52.6(2Y) R446.2
NetIC52_9: IC52.9(3A) IC52.11(4Y) R447.2
NetIC52_10: IC52.10(3~{OE}) R449.1 T20.3(D)

### Notes on the sheet
- Project/Equipment
- Document
- Designer
- Drawn by
- Check.by
- Copyright WUT ISE 2018.
  This documentation describes Open Hardware and is licensed under the CERN OHL v.1.1. You may redistribute and modify this documentation under the terms of the CERN OHL v.1.1. (http://ohwr.org/CERNOHL). This documentation is distributed WITHOUT ANY EXPRESS OR IMPLIED WARRANTY, INCLUDING OF MERCHANTABILITY, SATISFACTORY QUALITY AND FITNESS FOR A PARTICULAR PURPOSE. Please see the CERN OHL v.1.1 for applicable conditions.
- Contact
- File
- Last Mod.
- Print Date
- Sheet
- Size
- A3
- of
- Rev
- (in symbol R0402_10K_1%_0.0625W_100PPM) 1%
- (in symbol R0402_49R9_1%_0.0625W_100PPM) 1%

### Library data of the parts
C402 = CC0201_100NF_6.3V_10%_X5R: as C2 on sheet CPU_LPC1776; Manufacturer Part Number: CC0201_100NF_6.3V_10%_X5R; Part Number: CC0201_100NF_6.3V_10%_X5R; Value: 100nF; Component Kind: Standard; Component Type: Standard; Pin Count: 2; Status: Not Recommended; Case: 0201; Mounted: Yes; Socket: No; SMD: Yes; Sense: No; Manufacturer1 Example: AVX; Manufacturer1 ComponentHeight: 0.33mm; HelpURL: \\cern.ch\dfs\Applications\Altium\Datasheets\CC0201_X5R_AVX.pdf; Author: CERN DEM JLC; CreateDate: 03.12.2007; LatestRevisionDate: 03.12.2007
IC52 = SN74LVT125D: Quadruple Bus Buffer with 3-State Outputs; Manufacturer: TEXAS INSTRUMENTS; Part Description: 3.3V ABT Quadruple Bus Buffer with 3-State Outputs; PressFit: No; Bonding: No; Manufacturer Part Number: SN74LVT125D; PackageDescription: SOIC 14, Pitch 1.27mm - Body 4x8.75mm, IPC Medium Density; Part Number: SN74LVT125D; Component Kind: Standard; Component Type: Standard; Device: SN74LVT125D; Pin Count: 14; Case: SOIC14; Mounted: Yes; Socket: No; SMD: Yes; Sense: No; ComponentHeight: 1.75mm; Author: CERN DEM JLC; HelpURL: \\cern.ch\dfs\Applications\Altium\Datasheets\SN74LVT125D.pdf; CreateDate: 01.06.2011; LatestRevisionDate: 01.06.2011
R446 R447 = R0402_49R9_1%_0.0625W_100PPM: Resistor - 1%; Manufacturer: GENERIC; Part Description: General Purpose Thick Film Chip Resistor; Manufacturer1 Part Number: 232270674999L or RC0402FR-0749R9L; TC: ±100ppm/°C; PressFit: No; Manufacturer Part Number: R0402_49R9_1%_0.0625W_100PPM; Part Number: R0402_49R9_1%_0.0625W_100PPM; Tolerance: ±1%; Value: 49R9; Component Kind: Standard; Component Type: Standard; Pin Count: 2; Status: Not Recommended; Power: 0.0625W; Case: 0402; Mounted: Yes; Sense: No; Socket: No; SMD: Yes; Manufacturer1 Example: YAGEO PHYCOMP; Manufacturer1 ComponentHeight: 0.4mm; HelpURL: \\cern.ch\dfs\Applications\Altium\Datasheets\R0402_Phycomp_RC0402.pdf; Author: CERN DEM JLC; CreateDate: 24.10.2012; LatestRevisionDate: 24.10.2012
R448-R451 = R0402_10K_1%_0.0625W_100PPM: as R405-R407 on sheet CPU_LPC1776; Manufacturer Part Number: R0402_10K_1%_0.0625W_100PPM; Part Number: R0402_10K_1%_0.0625W_100PPM; Tolerance: ±1%; Value: 10k; Component Kind: Standard; Component Type: Standard; Pin Count: 2; Status: Not Recommended; Power: 0.0625W; Case: 0402; Mounted: Yes; Sense: No; Socket: No; SMD: Yes; Manufacturer1 Example: YAGEO PHYCOMP; Manufacturer1 ComponentHeight: 0.4mm; HelpURL: \\cern.ch\dfs\Applications\Altium\Datasheets\R0402_Phycomp_RC0402.pdf; Author: CERN DEM JLC; CreateDate: 03.12.2007; LatestRevisionDate: 17.10.2012
T19 T20 = BSS138LT1G: N-CHANNEL MOSFET WITH DIODE; Manufacturer: ON SEMICONDUCTOR; Part Description: 50V 200mA N-Channel Enhancement Mode Field-Effect Transistor; PressFit: No; Bonding: No; Manufacturer Part Number: BSS138LT1G; PackageDescription: SOT23 3-Leads, Pitch 0.95mm - Body 1.4x3mm, IPC Medium Density; Part Number: BSS138LT1G; Component Kind: Standard; Component Type: Standard; Device: BSS138LT1G; Pin Count: 3; Case: SOT23-3; Mounted: Yes; Socket: No; SMD: Yes; Sense: No; ComponentHeight: 1.11mm; HelpURL: \\cern.ch\dfs\Applications\Altium\Datasheets\BSS138LT1G.pdf; Author: CERN DEM JLC; CreateDate: 23.03.2009; LatestRevisionDate: 23.03.2009

## Sheet CPU_LPC1776_SUP_PROG.SchDoc: Sayma AMC
size 420 x 297 mm; CheckedBy: P.Kulik,T.Przywozki,W.Ruclo; Author: G.Kasprowicz; CompanyName: WUT ISE; DrawnBy: G.Kasprowicz; Organization: WUT ISE; Address1: PW ISE; Address2: Nowowiejska 15/19 00-665 Warsaw; Address3: gkasprow@gmail.com; DocumentNumber: 6; Revision: 2; SheetNumber: 6; SheetTotal: 32; ModifiedBy: -; CheckedDate: -; Title2: MMC supply & JTAG; DivGrp: WUT ISE; Designer: G.Kasprowicz; ModifiedDate: -; ProjectName: Sensor Box
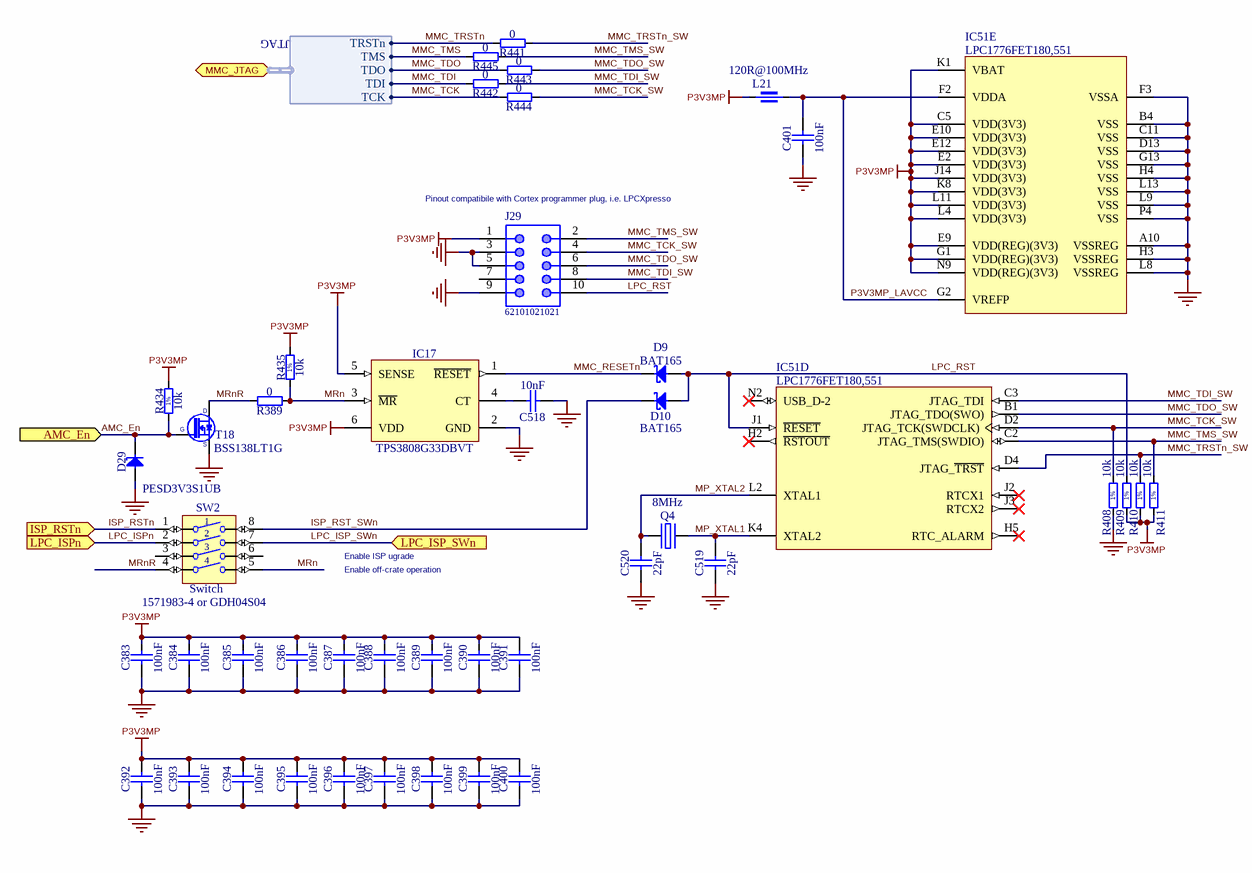
[diagram p20: CPU_LPC1776_SUP_PROG.SchDoc]

### Parts
C383  100nF  [CAPC0603X33N]
C384  100nF  [CAPC0603X33N]
C385  100nF  [CAPC0603X33N]
C386  100nF  [CAPC0603X33N]
C387  100nF  [CAPC0603X33N]
C388  100nF  [CAPC0603X33N]
C389  100nF  [CAPC0603X33N]
C390  100nF  [CAPC0603X33N]
C391  100nF  [CAPC0603X33N]
C392  100nF  [CAPC0603X33N]
C393  100nF  [CAPC0603X33N]
C394  100nF  [CAPC0603X33N]
C395  100nF  [CAPC0603X33N]
C396  100nF  [CAPC0603X33N]
C397  100nF  [CAPC0603X33N]
C398  100nF  [CAPC0603X33N]
C399  100nF  [CAPC0603X33N]
C400  100nF  [CAPC0603X33N]
C401  100nF  [CAPC0603X33N]
C518  10nF  [CAPC1005X55N]
C519  22pF  [CAPC1005X55N]
C520  22pF  [CAPC1005X55N]
D9  BAT165  [SOD2512X110N]
D10  BAT165  [SOD2512X110N]
D29  PESD3V3S1UB  [SODFL1608X65N]
IC17  TPS3808G33DBVT  [SOT95P280X145-6N]
IC51  LPC1776FET180,551  [BGA180C80P14X14_1200X1200X120]  (parts D,E of 5)
J29  62101021021  [62101021021]
L21  120R@100MHz  [INDC1608X95N]
Q4  8MHz  [XTAL_TXC_7A]
R389  0  [RESC1005X40N]
R408  10k  [RESC1005X40N]
R409  10k  [RESC1005X40N]
R410  10k  [RESC1005X40N]
R411  10k  [RESC1005X40N]
R434  10k  [RESC1005X40N]
R435  10k  [RESC1005X40N]
R441  0  [RESC1005X40N]
R442  0  [RESC1005X40N]
R443  0  [RESC1005X40N]
R444  0  [RESC1005X40N]
R445  0  [RESC1005X40N]
SW2  Switch  Manufacturer Part Number: 1571983-4 or GDH04S04  [SW_TYCO_1571983-4]
T18  BSS138LT1G  [SOT95P240X110-3N]

### Ports
AMC_En (in), ISP_RSTn (in), LPC_ISP_SWn (in), LPC_ISPn (in), MMC_JTAG (bidir, harness JTAG)

### Harnesses
JTAG: TCK, TDI, TDO, TMS, TRSTn

### Nets
GND: C383.2 C384.2 C385.2 C386.2 C387.2 C388.2 C389.2 C390.2 C391.2 C392.2 C393.2 C394.2 C395.2 C396.2 C397.2 C398.2 C399.2 C400.2 C401.2 C518.1 C519.1 C520.1 D29.2(A) IC17.2(GND) IC51.A10(VSSREG) IC51.B4(VSS) IC51.C11(VSS) IC51.D13(VSS) IC51.F3(VSSA) IC51.G13(VSS) IC51.H3(VSSREG) IC51.H4(VSS) IC51.L8(VSSREG) IC51.L9(VSS) IC51.L13(VSS) IC51.P4(VSS) J29.3 J29.5 J29.9 R408.1 T18.2(S)
P3V3MP: C383.1 C384.1 C385.1 C386.1 C387.1 C388.1 C389.1 C390.1 C391.1 C392.1 C393.1 C394.1 C395.1 C396.1 C397.1 C398.1 C399.1 C400.1 IC17.5(SENSE) IC17.6(VDD) IC51.C5(VDD(3V3)) IC51.E2(VDD(3V3)) IC51.E9(VDD(REG)(3V3)) IC51.E10(VDD(3V3)) IC51.E12(VDD(3V3)) IC51.G1(VDD(REG)(3V3)) IC51.J14(VDD(3V3)) IC51.K1(VBAT) IC51.K8(VDD(3V3)) IC51.L4(VDD(3V3)) IC51.L11(VDD(3V3)) IC51.N9(VDD(REG)(3V3)) J29.1 L21.2 R409.1 R410.1 R411.1 R434.2 R435.2
AMC_En: D29.1(C) R434.1 T18.1(G) ; port AMC_En
ISP_RST_SWn: D10.1(C) SW2.8
ISP_RSTn: SW2.1 ; port ISP_RSTn
LPC_ISP_SWn: SW2.7 ; port LPC_ISP_SWn
LPC_ISPn: SW2.2 ; port LPC_ISPn
LPC_RST: D9.2(A) D10.2(A) IC51.J1(~{RESET}) J29.10 R409.2
MMC_RESETn: D9.1(C) IC17.1(~{RESET})
MMC_TCK: R444.2 ; port MMC_JTAG.TCK
MMC_TCK_SW: IC51.D2(JTAG_TCK(SWDCLK)) J29.4 R408.2 R444.1
MMC_TDI: R442.2 ; port MMC_JTAG.TDI
MMC_TDI_SW: IC51.C3(JTAG_TDI) J29.8 R442.1
MMC_TDO: R443.2 ; port MMC_JTAG.TDO
MMC_TDO_SW: IC51.B1(JTAG_TDO(SWO)) J29.6 R443.1
MMC_TMS: R445.2 ; port MMC_JTAG.TMS
MMC_TMS_SW: IC51.C2(JTAG_TMS(SWDIO)) J29.2 R411.2 R445.1
MMC_TRSTn: R441.2 ; port MMC_JTAG.TRSTn
MMC_TRSTn_SW: IC51.D4(JTAG_~{TRST}) R410.2 R441.1
MP_XTAL1: C519.2 IC51.K4(XTAL2) Q4.2(OSC2)
MP_XTAL2: C520.2 IC51.L2(XTAL1) Q4.1(OSC1)
MRn: IC17.3(~{MR}) R389.1 R435.1 SW2.5
MRnR: R389.2 SW2.4 T18.3(D)
P3V3MP_LAVCC: C401.1 IC51.F2(VDDA) IC51.G2(VREFP) L21.1
NetC518_2: C518.2 IC17.4(CT)

Not connected (* = marked no-connect by the designer): IC51 H2(~{RSTOUT})* H5(RTC_ALARM)* J2(RTCX1)* J3(RTCX2)* N2(USB_D-2)*; J29 7; SW2 3 6

### Notes on the sheet
- (near J29) Pinout compatibile with Cortex programmer plug, i.e. LPCXpresso
- Enable ISP ugrade
- Enable off-crate operation
- Project/Equipment
- Document
- Designer
- Drawn by
- Check.by
- Copyright WUT ISE 2018.
  This documentation describes Open Hardware and is licensed under the CERN OHL v.1.1. You may redistribute and modify this documentation under the terms of the CERN OHL v.1.1. (http://ohwr.org/CERNOHL). This documentation is distributed WITHOUT ANY EXPRESS OR IMPLIED WARRANTY, INCLUDING OF MERCHANTABILITY, SATISFACTORY QUALITY AND FITNESS FOR A PARTICULAR PURPOSE. Please see the CERN OHL v.1.1 for applicable conditions.
- Contact
- File
- Last Mod.
- Print Date
- Sheet
- Size
- A3
- of
- Rev
- (in symbol R0402_10K_1%_0.0625W_100PPM) 1%

### Library data of the parts
C383-C401 = CC0201_100NF_6.3V_10%_X5R: as C2 on sheet CPU_LPC1776; Manufacturer Part Number: CC0201_100NF_6.3V_10%_X5R; Part Number: CC0201_100NF_6.3V_10%_X5R; Value: 100nF; Component Kind: Standard; Component Type: Standard; Pin Count: 2; Status: Not Recommended; Case: 0201; Mounted: Yes; Socket: No; SMD: Yes; Sense: No; Manufacturer1 Example: AVX; Manufacturer1 ComponentHeight: 0.33mm; HelpURL: \\cern.ch\dfs\Applications\Altium\Datasheets\CC0201_X5R_AVX.pdf; Author: CERN DEM JLC; CreateDate: 03.12.2007; LatestRevisionDate: 03.12.2007
C518 = CC0402_10NF_16V_10%_X7R: Non-polarised capacitor; Manufacturer: GENERIC; Part Description: SMD Multilayer Chip Ceramic Capacitor; Manufacturer1 Part Number: 223878715636; Tolerance: ±10%; Voltage: 16V; TC: X7R; Manufacturer Part Number: CC0402_10NF_16V_10%_X7R; Part Number: CC0402_10NF_16V_10%_X7R; Value: 10nF; Component Kind: Standard; Component Type: Standard; Pin Count: 2; Status: Not Recommended; Case: 0402; Mounted: Yes; Socket: No; SMD: Yes; Sense: No; Manufacturer1 Example: PHYCOMP; Manufacturer1 ComponentHeight: 0.55mm; HelpURL: \\cern.ch\dfs\Applications\Altium\Datasheets\CC0402_X7R_PHYCOMP.pdf; Author: CERN DEM JLC; CreateDate: 03.12.2007; LatestRevisionDate: 03.12.2007
C519 C520 = CC0402_22PF_50V_5%_C0G: Non-polarised capacitor; Manufacturer: GENERIC; Part Description: SMD Multilayer Chip Ceramic Capacitor; Manufacturer1 Part Number: C0402C220J5GACTU; Tolerance: ±5%; Voltage: 50V; TC: C0G/NP0; Manufacturer Part Number: CC0402_22PF_50V_5%_C0G; Part Number: CC0402_22PF_50V_5%_C0G; Value: 22pF; Component Kind: Standard; Component Type: Standard; Pin Count: 2; Status: Preferred; Case: 0402; Mounted: Yes; Socket: No; SMD: Yes; Sense: No; Manufacturer1 Example: KEMET; Manufacturer1 ComponentHeight: 0.55mm; HelpURL: \\cern.ch\dfs\Applications\Altium\Datasheets\CC0805_C0G_KEMET_(Commercial Grade).pdf; Author: CERN DEM JLC; CreateDate: 03.12.2007; LatestRevisionDate: 03.12.2007
D9 D10 = BAT165: Schottky Diode; Manufacturer: INFINEON; Part Description: Medium Power AF Schottky Diode; Voltage: 40V; Power: 750mA; PressFit: No; Bonding: No; Manufacturer Part Number: BAT165; PackageDescription: Small Outline Diode (SOD-323), 1.70mm W X 1.25mm L X 1.10mm H body,  IPC Medium Density; Part Number: BAT165; Component Kind: Standard; Component Type: Standard; Device: BAT165; Pin Count: 2; Case: SOD323; Mounted: Yes; Socket: No; SMD: Yes; Sense: No; ComponentHeight: 1.1mm; HelpURL: \\cern.ch\dfs\Applications\Altium\Datasheets\BAT165.pdf; Author: CERN DEM JLC; CreateDate: 12.11.2014; LatestRevisionDate: 12.11.2014
D29 = PESD3V3S1UB: as D23-D28 on sheet CPU_LPC1776; Manufacturer Part Number: PESD3V3S1UB; PackageDescription: Ultra Small Outline Diode Flat Lead (SOD-523), Body; 1.2mm L X 0.8mm W X 0.65mm H, IPC Medium Density; Part Number: PESD3V3S1UB; Component Kind: Standard; Component Type: Standard; Device: PESD3V3S1UB; Pin Count: 2; Case: SOD523; Mounted: Yes; Socket: No; SMD: Yes; Sense: No; ComponentHeight: 0.65mm; HelpURL: \\cern.ch\dfs\Applications\Altium\Datasheets\PESD3V3S1UB.pdf; Author: CERN DEM JLC; CreateDate: 29.11.2012; LatestRevisionDate: 29.11.2012
IC17 = TPS3808G33DBVT: Low Quiescent Current, Programmable-Delay Supervisory Circuit; Manufacturer: TEXAS INSTRUMENTS; Part Description: 3.3V, Low Quiescent Current, Programmable-Delay Supervisory Circuit; PressFit: No; Bonding: No; Manufacturer Part Number: TPS3808G33DBVT; PackageDescription: SOT23, 6-Leads, Body 1.6x3.0mm, Pitch 0.95mm, IPC Medium Density; Part Number: TPS3808G33DBVT; Component Kind: Standard; Component Type: Standard; Device: TPS3808G33DBVT; Pin Count: 6; Case: SOT23-6; Mounted: Yes; Socket: No; SMD: Yes; Sense: No; ComponentHeight: 1.45mm; Author: CERN DEM JLC; HelpURL: \\cern.ch\dfs\Applications\Altium\Datasheets\TPS3808G33DBVT.pdf; CreateDate: 05.11.2013; LatestRevisionDate: 05.11.2013
IC51 = LPC1776FET180,551: as IC51 on sheet CPU_LPC1776; Manufacturer Part Number: LPC1776FET180,551; PackageDescription: BGA, 0.80mm Pitch, Square; 180 Pin, 14 Columns X 14 Rows, Body 12.00mm X 12.00mm X 1.20mm H, IPC Medium Density; Part Number: LPC1776FET180,551; Component Kind: Standard; Component Type: Standard; Device: LPC1776FET180,551; Pin Count: 180; Case: BGA180; Mounted: Yes; Socket: No; SMD: Yes; Sense: No; ComponentHeight: 1.2mm; HelpURL: \\cern.ch\dfs\Applications\Altium\Datasheets\LPC1776FET180,551.pdf; Author: CERN DEM JMW; CreateDate: 16.08.2016; LatestRevisionDate: 16.08.2016
J29 = 62101021021: SMT Vertical Pin Header WR-PHD, Pitch 1.27 mm, Dual Row, 10 pins; Pin Number: 10; Pitch: 1.27 mm; Gender: Male; Rated Current: 1 A; Working Voltage: 100 VAC; Withstanding Voltage: 500 VAC; Contact Resistance: 20 mOhm; ComponentLink1Description: Manufacturer; ComponentLink1URL: http://www.we-online.de; ComponentLink2Description: Datasheet; ComponentLink2URL: https://katalog.we-online.de/em/datasheet/62101021021.pdf; Part Number: 62101021021; Published Date: August 2018; Publisher: Wurth Elektronik; Operating Temperature: -40 to 105 degC; Mounting Technology: SMT; Packaging: Tube; Row Number: Dual; Orientation: Vertical
L21 = IND0603_MURATA_BLM18PG121SN1D: Manufacturer: MURATA; Part Description: SMD EMIFIL Chip Ferrite Bead; Power: 2A; Resistance: 0.05R; Manufacturer Part Number: BLM18PG121SN1D; Part Number: IND0603_MURATA_BLM18PG121SN1D; Value: 120R@100MHz; Component Kind: Standard; Component Type: Standard; Pin Count: 2; Status: None; Case: 0603; Mounted: Yes; Socket: No; SMD: Yes; Sense: No; ComponentHeight: 0.95mm; HelpURL: \\cern.ch\dfs\Applications\Altium\Datasheets\IND0603_MURATA_BLM18P.pdf; Author: CERN DEM BC; CreateDate: 27.07.2015; LatestRevisionDate: 25.10.2018
Q4 = XTAL_8MHZ_TXC_7A-8.000MAAE-T: Quartz Crystal; Manufacturer: TXC CORPORATION; Part Description: Tolerance: ±30ppm, Stability: ±30ppm, -20°C to +70°C, 12pF, SMD Glass Seam Sealing Crystal, 7A Series; PressFit: No; Bonding: No; Manufacturer Part Number: 7A-8.000MAAE-T; PackageDescription: 2 Pins, 3.2x5mm, SMD Glass Seam Sealing Crystal, 7A Serie; Part Number: XTAL_8MHZ_TXC_7A-8.000MAAE-T; Value: 8MHz; Component Kind: Standard; Component Type: Standard; Pin Count: 2; Mounted: Yes; Socket: No; SMD: Yes; Sense: No; ComponentHeight: 1.2mm; HelpURL: \\cern.ch\dfs\Applications\Altium\Datasheets\XTAL_TXC_7A.pdf; Author: CERN DEM JLC; CreateDate: 09.10.2014; LatestRevisionDate: 12.11.2014
R389 R441-R445 = R0402_0R_JUMPER: as R418-R421 on sheet CPU_LPC1776; Manufacturer Part Number: R0402_0R_JUMPER; Part Number: R0402_0R_JUMPER; Value: 0; Component Kind: Standard; Component Type: Standard; Pin Count: 2; Status: Not Recommended; Case: 0402; Mounted: Yes; Sense: No; Socket: No; SMD: Yes; Manufacturer1 Example: YAGEO PHYCOMP; Manufacturer1 ComponentHeight: 0.4mm; HelpURL: \\cern.ch\dfs\Applications\Altium\Datasheets\R0402_Phycomp_RC0402.pdf; Author: CERN DEM JLC; CreateDate: 03.12.2007; LatestRevisionDate: 17.10.2012
R408-R411 R434 R435 = R0402_10K_1%_0.0625W_100PPM: as R405-R407 on sheet CPU_LPC1776; Manufacturer Part Number: R0402_10K_1%_0.0625W_100PPM; Part Number: R0402_10K_1%_0.0625W_100PPM; Tolerance: ±1%; Value: 10k; Component Kind: Standard; Component Type: Standard; Pin Count: 2; Status: Not Recommended; Power: 0.0625W; Case: 0402; Mounted: Yes; Sense: No; Socket: No; SMD: Yes; Manufacturer1 Example: YAGEO PHYCOMP; Manufacturer1 ComponentHeight: 0.4mm; HelpURL: \\cern.ch\dfs\Applications\Altium\Datasheets\R0402_Phycomp_RC0402.pdf; Author: CERN DEM JLC; CreateDate: 03.12.2007; LatestRevisionDate: 17.10.2012
SW2 = SW_TYCO_1571983-4: 4 Ways SPST DIP Switch; Manufacturer: TYCO; Part Description: 4 Way SPST SMD DIP Switch, Latched, Contact Rating 0.025A 24VDC; PressFit: No; PackageDescription: Pitch 1.27mm,  Body 6.2x6.2mm, 4 Ways SPST Surface-Mount DIP Switch, TYCO GDH Series; Part Number: SW_TYCO_1571983-4; Component Kind: Standard; Component Type: Standard; Pin Count: 8; Family: Switch; Mounted: Yes; Socket: No; SMD: Yes; Sense: No; Status: None; ComponentHeight: 2.31mm; HelpURL: \\cern.ch\dfs\Applications\Altium\Datasheets\SW_TYCO_1571983-4.pdf; Author: CERN DEM JLC; CreateDate: 08.01.2009; LatestRevisionDate: 08.01.2009
T18 = BSS138LT1G: as T19 on sheet DUAL_IO_TTL_BUFFER; Manufacturer Part Number: BSS138LT1G; PackageDescription: SOT23 3-Leads, Pitch 0.95mm - Body 1.4x3mm, IPC Medium Density; Part Number: BSS138LT1G; Component Kind: Standard; Component Type: Standard; Device: BSS138LT1G; Pin Count: 3; Case: SOT23-3; Mounted: Yes; Socket: No; SMD: Yes; Sense: No; ComponentHeight: 1.11mm; HelpURL: \\cern.ch\dfs\Applications\Altium\Datasheets\BSS138LT1G.pdf; Author: CERN DEM JLC; CreateDate: 23.03.2009; LatestRevisionDate: 23.03.2009